# EAGLE design ENGI301_Maze_Project_v2 (EAGLE 9.0.0)
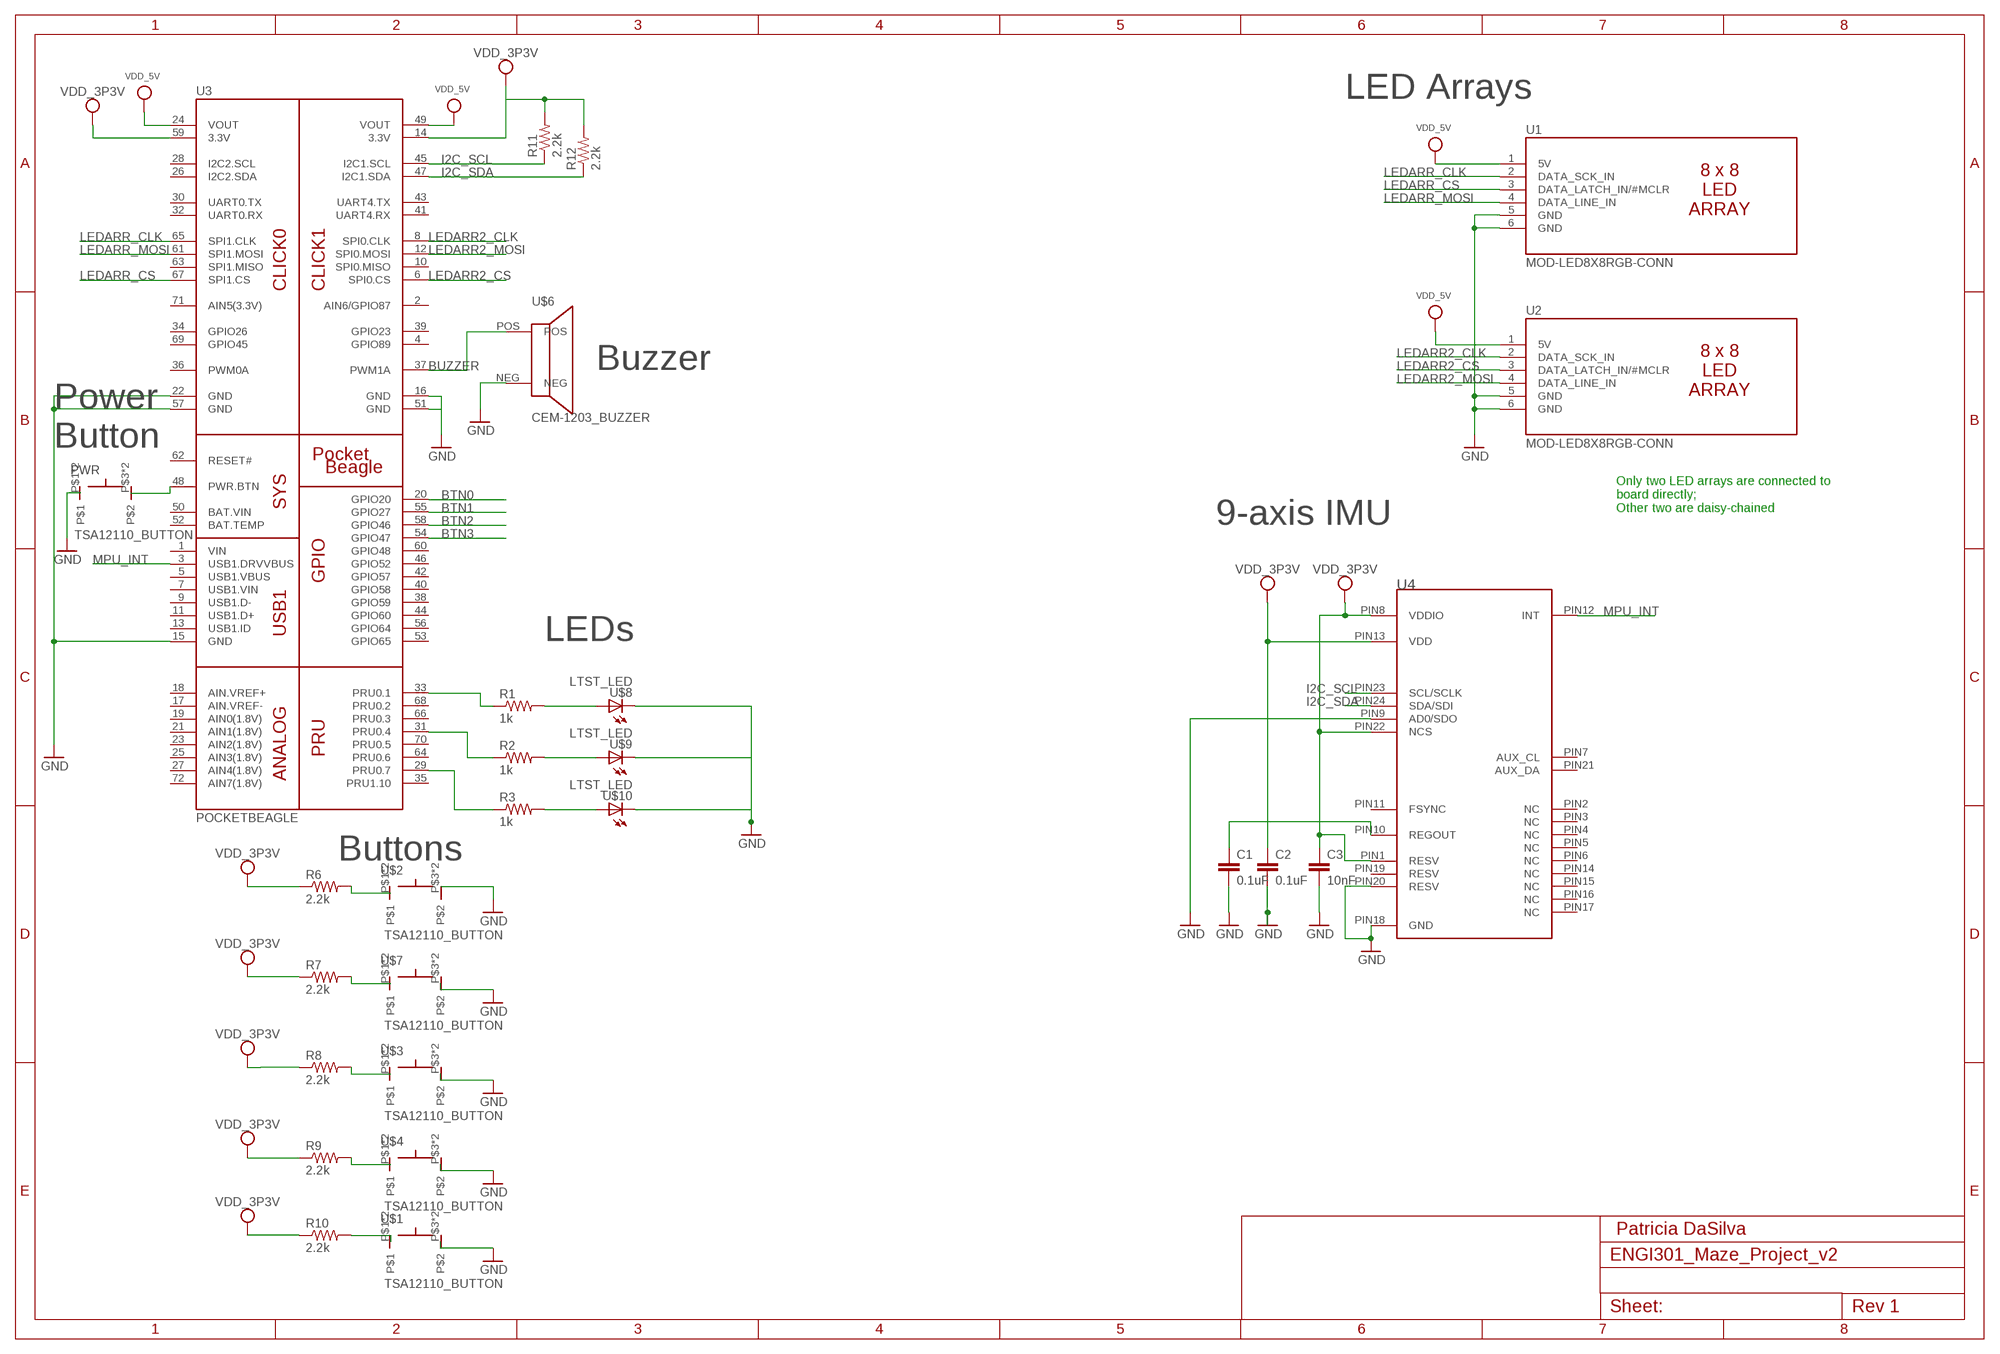
[diagram p0: schematic, sheet 1]

## Parts
C1  0.1uF  C_C0402  [C0402]
C2  0.1uF  C_C0402  [C0402]
C3  10nF  C_C0402  [C0402]
PWR  TSA12110_BUTTON  [4HOLE-THRU]
R1  1k  R_R0603  [R0603]
R2  1k  R_R0603  [R0603]
R3  1k  R_R0603  [R0603]
R6  2.2k  R_R0603  [R0603]
R7  2.2k  R_R0603  [R0603]
R8  2.2k  R_R0603  [R0603]
R9  2.2k  R_R0603  [R0603]
R10  2.2k  R_R0603  [R0603]
R11  2.2k  R_R0603  [R0603]
R12  2.2k  R_R0603  [R0603]
U1  MOD-LED8X8RGB-CONN  [FE06W]
U2  MOD-LED8X8RGB-CONN  [FE06W]
U3  POCKETBEAGLE  [POCKETBEAGLE]
U4  IMU_MPU9250  [IMU_QFN_3MMX3MM]
U$1  TSA12110_BUTTON  [4HOLE-THRU]
U$2  TSA12110_BUTTON  [4HOLE-THRU]
U$3  TSA12110_BUTTON  [4HOLE-THRU]
U$4  TSA12110_BUTTON  [4HOLE-THRU]
U$6  CEM-1203_BUZZER  [2HOLE-THRU]
U$7  TSA12110_BUTTON  [4HOLE-THRU]
U$8  LTST_LED  [SMD_0.8X0.8MM]
U$9  LTST_LED  [SMD_0.8X0.8MM]
U$10  LTST_LED  [SMD_0.8X0.8MM]

## Nets
BTN0: U3.20(GPIO20)
BTN1: U3.55(GPIO27)
BTN2: U3.58(GPIO46)
BTN3: U3.54(GPIO47)
BUZZER: U3.37(PWM1A) U$6.POS
GND: C1.2 C2.2 C3.2 PWR.P$1 PWR.P$2 U1.5(GND) U1.6(GND) U2.5(GND) U2.6(GND) U3.15(GND) U3.16(GND) U3.22(GND) U3.51(GND) U3.57(GND) U4.PIN9(AD0/SDO) U4.PIN18(GND) U4.PIN20(RESV) U$1.P$3 U$1.P$4 U$3.P$3 U$3.P$4 U$4.P$3 U$4.P$4 U$6.NEG U$7.P$3 U$7.P$4 U$8.C(CATHODE) U$9.C(CATHODE) U$10.C(CATHODE)
I2C_SCL: R11.1 U3.45(I2C1.SCL) U4.PIN23(SCL/SCLK)
I2C_SDA: R12.1 U3.47(I2C1.SDA) U4.PIN24(SDA/SDI)
LEDARR2_CLK: U2.2(DATA_SCK_IN) U3.8(SPI0.CLK)
LEDARR2_CS: U2.3(DATA_LATCH_IN/#MCLR) U3.6(SPI0.CS)
LEDARR2_MOSI: U2.4(DATA_LINE_IN) U3.12(SPI0.MOSI)
LEDARR_CLK: U1.2(DATA_SCK_IN) U3.65(SPI1.CLK)
LEDARR_CS: U1.3(DATA_LATCH_IN/#MCLR) U3.67(SPI1.CS)
LEDARR_MOSI: U1.4(DATA_LINE_IN) U3.61(SPI1.MOSI)
MPU_INT: U3.3(USB1.DRVVBUS) U4.PIN12(INT)
N$1: PWR.P$3 PWR.P$4 U3.48(PWR.BTN)
N$2: R1.1 U3.33(PRU0.1)
N$3: R2.1 U3.31(PRU0.4)
N$4: C1.1 U4.PIN10(REGOUT)
N$5: R3.1 U3.29(PRU0.7)
N$6: R6.2 U$2.P$1 U$2.P$2
N$7: R1.2 U$8.A(ANODE)
N$8: R7.2 U$7.P$1 U$7.P$2
N$9: R2.2 U$9.A(ANODE)
N$10: R8.2 U$3.P$1 U$3.P$2
N$11: R3.2 U$10.A(ANODE)
N$12: R9.2 U$4.P$1 U$4.P$2
N$13: R10.2 U$1.P$1 U$1.P$2
SYS_VDD1_3P3V: C2.1 C3.1 R6.1 R7.1 R8.1 R9.1 R10.1 R11.2 R12.2 U3.14(3.3V) U3.59(3.3V) U4.PIN1(RESV) U4.PIN8(VDDIO) U4.PIN13(VDD) U4.PIN22(NCS) ; supply symbol labelled VDD_3P3V
SYS_VDD1_5V: U1.1(5V) U2.1(5V) U3.24(VOUT) U3.49(VOUT) ; supply symbol labelled VDD_5V
Unconnected: U3.1(VIN) U3.2(AIN6/GPIO87) U3.4(GPIO89) U3.5(USB1.VBUS) U3.7(USB1.VIN) U3.9(USB1.D-) U3.10(SPI0.MISO) U3.11(USB1.D+) U3.13(USB1.ID) U3.17(AIN.VREF-) U3.18(AIN.VREF+) U3.19(AIN0(1.8V)) U3.21(AIN1(1.8V)) U3.23(AIN2(1.8V)) U3.25(AIN3(1.8V)) U3.26(I2C2.SDA) U3.27(AIN4(1.8V)) U3.28(I2C2.SCL) U3.30(UART0.TX) U3.32(UART0.RX) U3.34(GPIO26) U3.35(PRU1.10) U3.36(PWM0A) U3.38(GPIO59) U3.39(GPIO23) U3.40(GPIO58) U3.41(UART4.RX) U3.42(GPIO57) U3.43(UART4.TX) U3.44(GPIO60) U3.46(GPIO52) U3.50(BAT.VIN) U3.52(BAT.TEMP) U3.53(GPIO65) U3.56(GPIO64) U3.60(GPIO48) U3.62(RESET#) U3.63(SPI1.MISO) U3.64(PRU0.6) U3.66(PRU0.3) U3.68(PRU0.2) U3.69(GPIO45) U3.70(PRU0.5) U3.71(AIN5(3.3V)) U3.72(AIN7(1.8V)) U4.PIN2(NC) U4.PIN3(NC) U4.PIN4(NC) U4.PIN5(NC) U4.PIN6(NC) U4.PIN7(AUX_CL) U4.PIN11(FSYNC) U4.PIN14(NC) U4.PIN15(NC) U4.PIN16(NC) U4.PIN17(NC) U4.PIN19(RESV) U4.PIN21(AUX_DA) U$2.P$3 U$2.P$4

## Notes on the sheet
- LED Arrays
- Buzzer
- Power 
  Button
- Only two LED arrays are connected to 
  board directly; 
  Other two are daisy-chained
- 9-axis IMU
- LEDs
- Buttons
- Patricia DaSilva

## Library data of the parts
C1-C3 = IMU:C_: Capacitor SMD. Sizes: 0402, 0603 & 0805
PWR U$1-U$4 U$7 = Project#2:TSA12110_BUTTON: A 4-pin button
R1-R3 R6-R12 = Project#2:R_: RESISTOR, American symbol
U1 U2 = Project#2:MOD-LED8X8RGB-CONN
U3 = Project#2:POCKETBEAGLE
U4 = Project#2:IMU_MPU9250: MPU9250 is a motion tracking device consisting of a QFN (3mm x 3mm) package
U$6 = Project#2:CEM-1203_BUZZER: A buzzer
U$8-U$10 = Project#2:LTST_LED: An LED ( 0.8x0.8MM SMD )

## Board
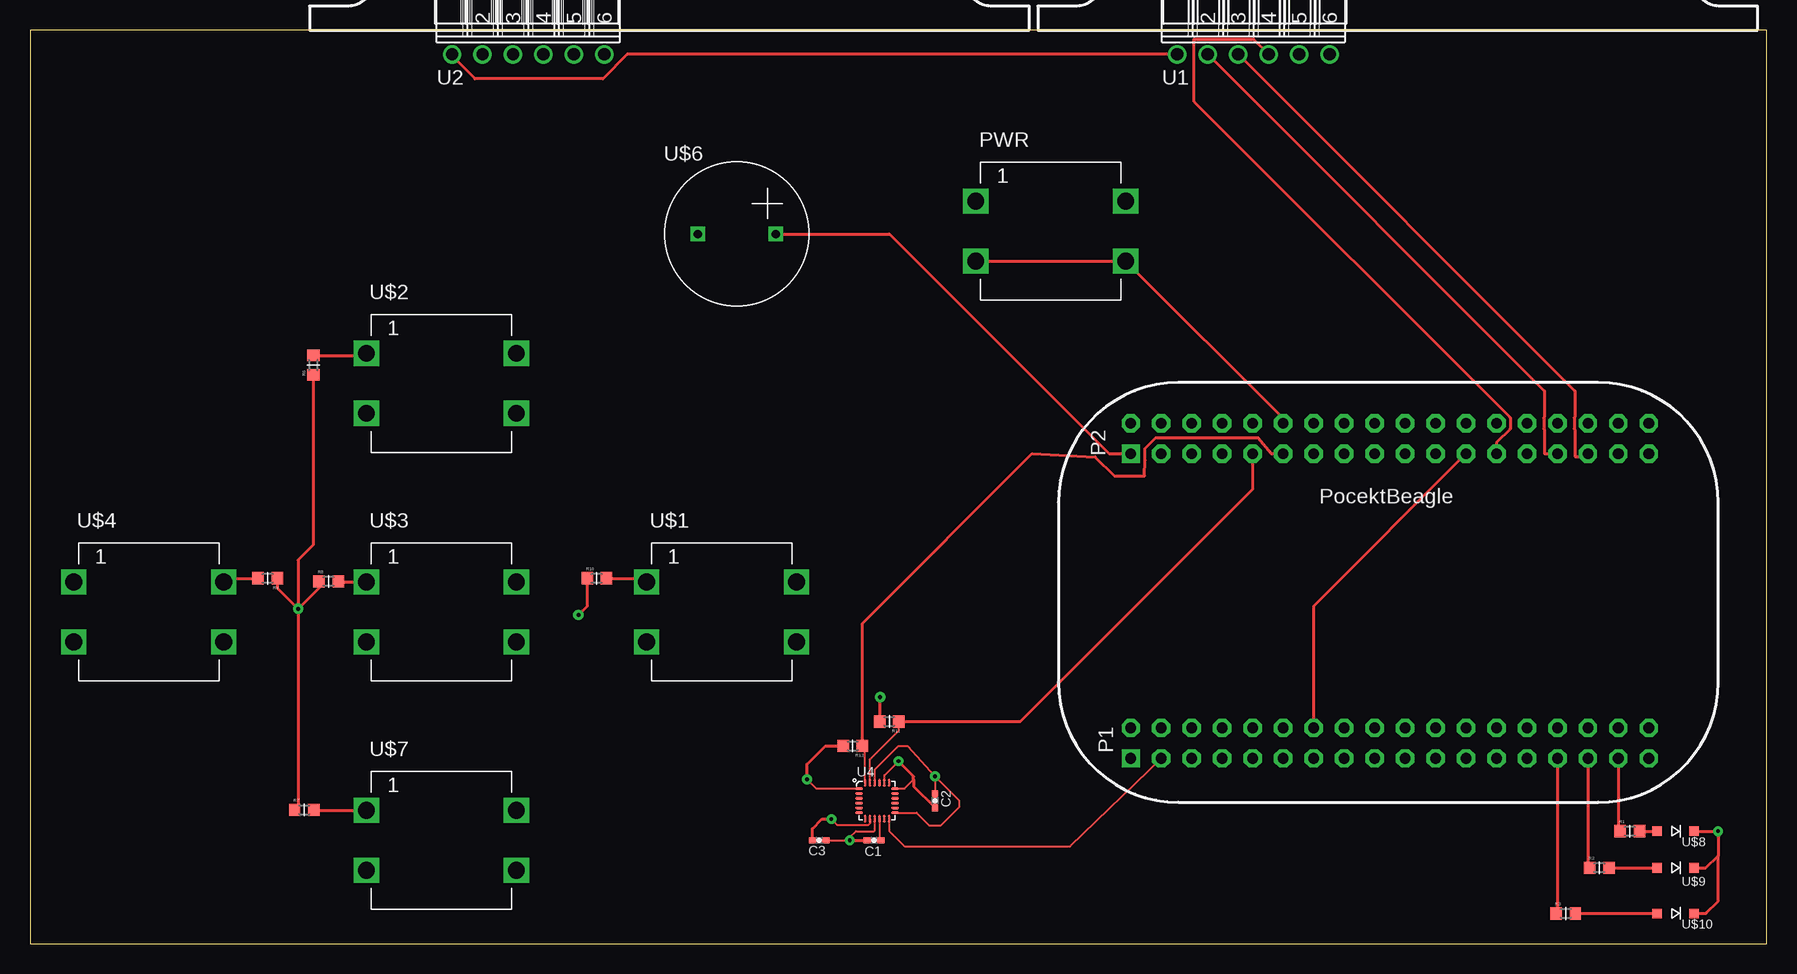
[diagram p1: board, top side]
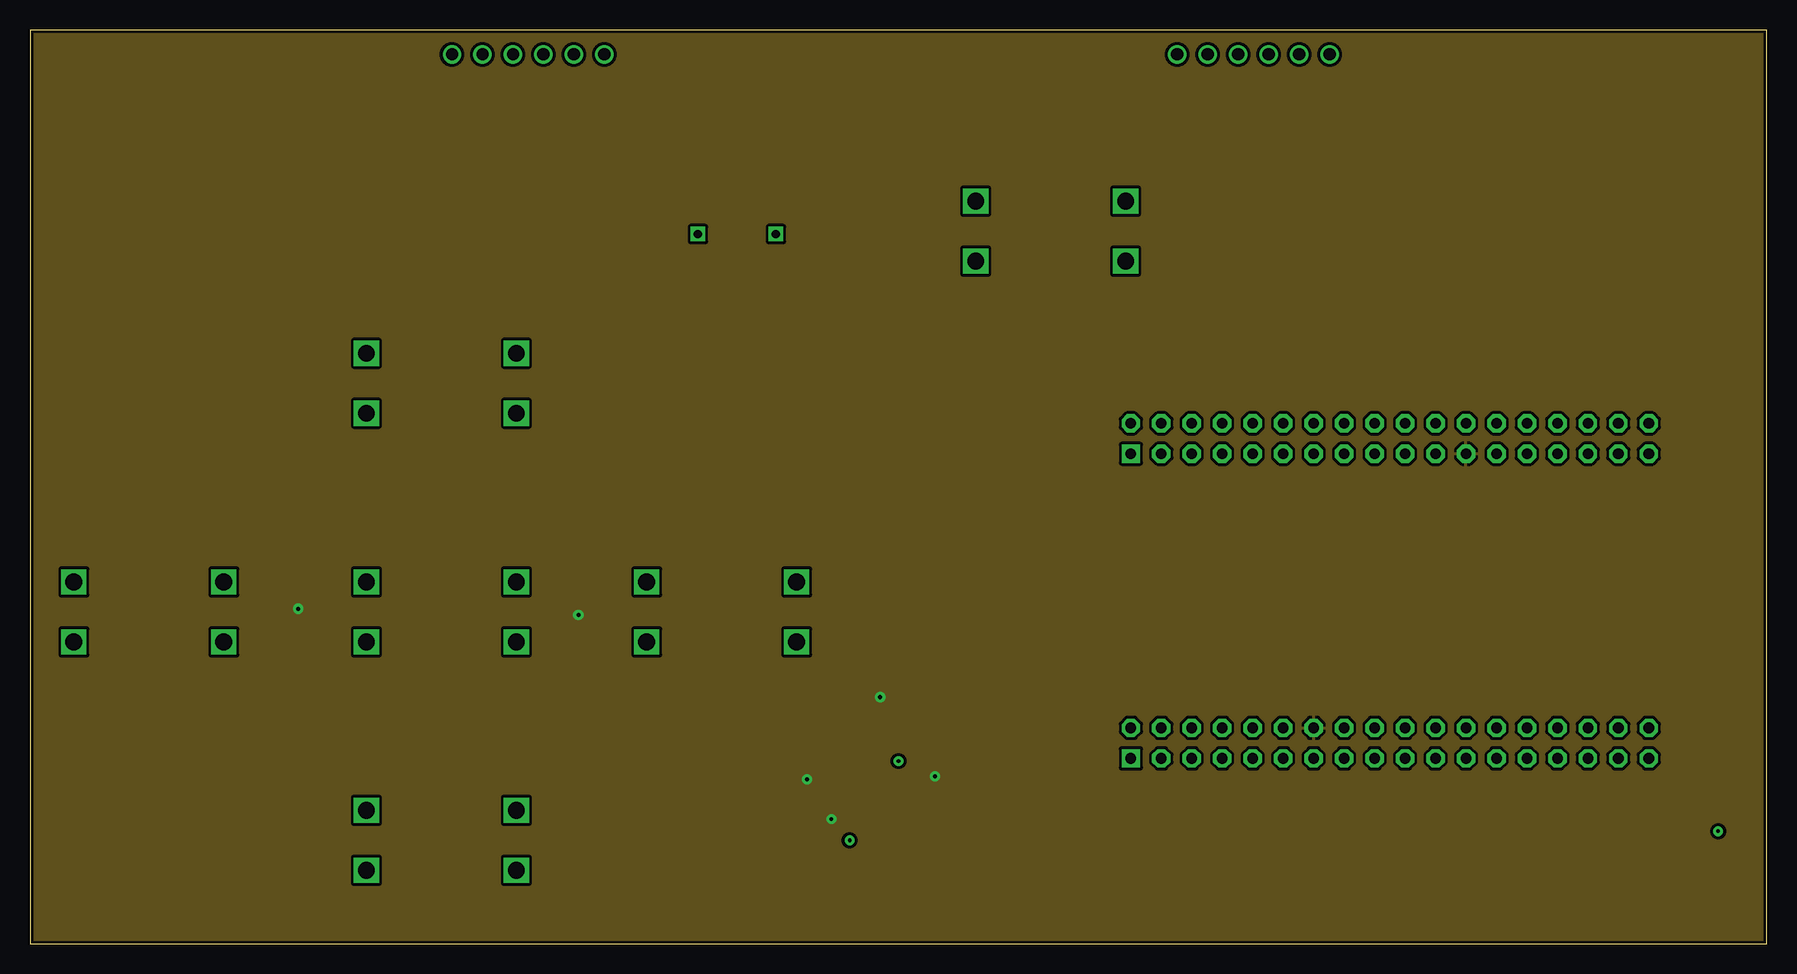
[diagram p2: board, inner layer Route2]
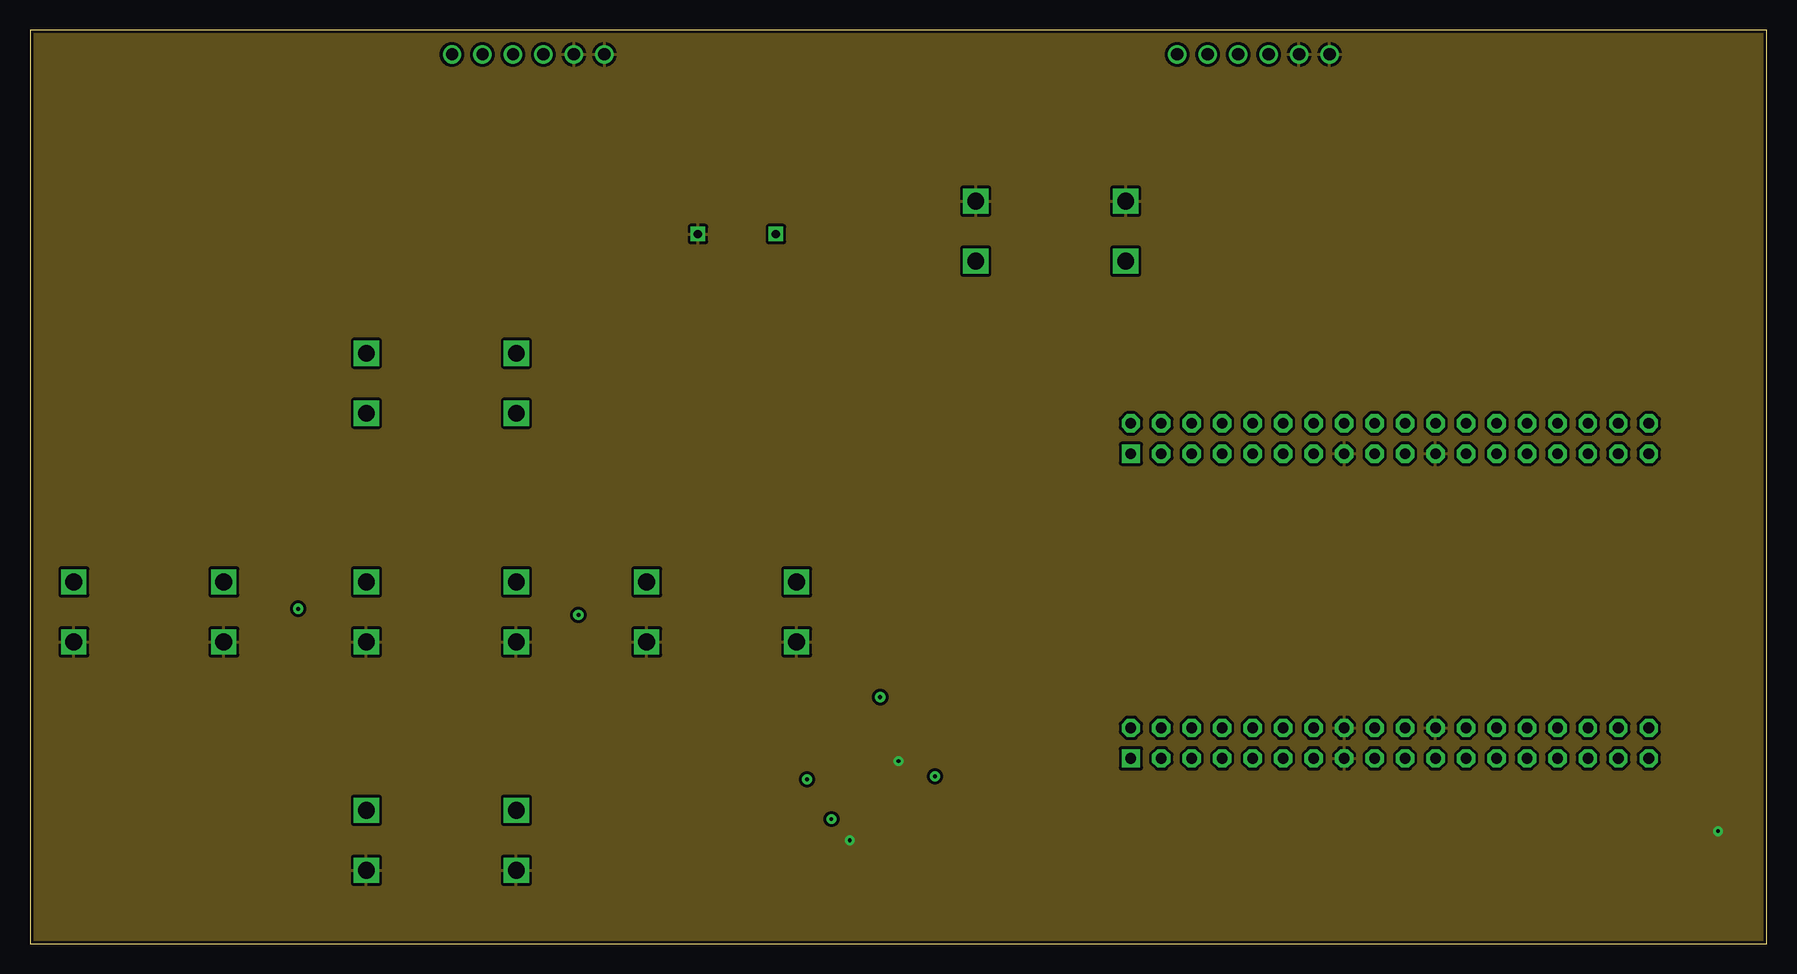
[diagram p3: board, inner layer Route15]
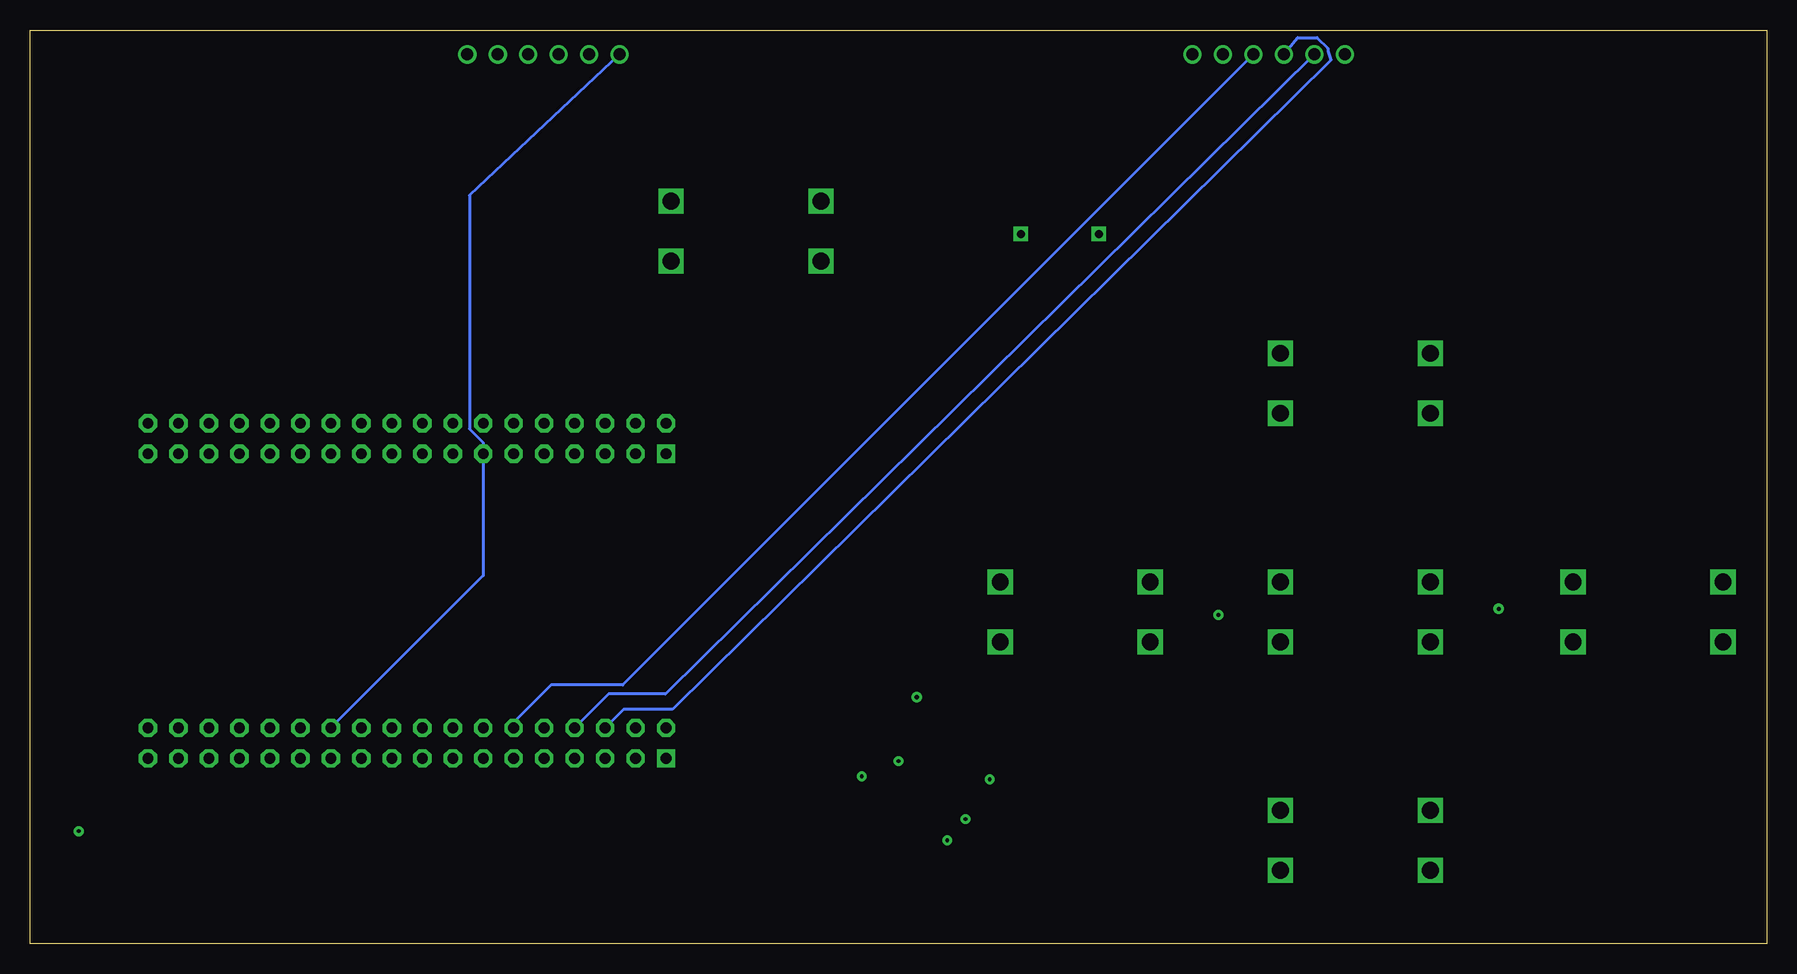
[diagram p4: board, bottom side, seen from below]

Size 144.78 x 76.2 mm. Coordinates in mm from the lower left corner, seen from the top.
Outline: 0,0 144.78,0 144.78,76.2 0,76.2 0,0
Copper layers (1*2*15*16): Top 0.035mm / dielectric 0.23mm / Route2 0.035mm / dielectric 0.93mm / Route15 0.035mm / dielectric 0.23mm / Bottom 0.035mm
Design rules "ENGI301_Maze_Project_4lyr": minimum track width 10mil, minimum drill 12mil, track to track 10mil, track to pad 10mil, pad to pad 10mil, via to via 10mil, smd to smd 10mil, copper to edge 10mil, drill to drill 12mil, minimum pad ring 10mil, minimum via ring 10mil, stop-mask expansion 3mil, vias tented up to drill 25mil, thermal gap 10mil

### Footprints (pad centres in the part's own frame; a part is rotated, then mirrored left to right if it is on the bottom)
C0402 = smd 0.61 x 0.508: 1 -0.559,0; 2 0.559,0
4HOLE-THRU = drill 1.4 square: P$1 -6.25,2.5; P$2 6.25,2.5; P$3 -6.25,-2.5; P$4 6.25,-2.5
R0603 = smd 0.95 x 1.031: 1 -0.8,0; 2 0.8,0
FE06W = drill 1.016: 1 -6.35,0; 2 -3.81,0; 3 -1.27,0; 4 1.27,0; 5 3.81,0; 6 6.35,0
POCKETBEAGLE = drill 0.889 pad 1.524 square: 1 5.91,3.53; 37 5.91,28.93 | drill 0.889 pad 1.524 octagon: 2 5.91,6.07; 3 8.45,3.53; 4 8.45,6.07; 5 10.99,3.53; 6 10.99,6.07; 7 13.53,3.53; 8 13.53,6.07; 9 16.07,3.53; 10 16.07,6.07; 11 18.61,3.53; 12 18.61,6.07; 13 21.15,3.53; 14 21.15,6.07; 15 23.69,3.53; 16 23.69,6.07; 17 26.23,3.53; 18 26.23,6.07; 19 28.77,3.53; 20 28.77,6.07; 21 31.31,3.53; 22 31.31,6.07; 23 33.85,3.53; 24 33.85,6.07; 25 36.39,3.53; 26 36.39,6.07; 27 38.93,3.53; 28 38.93,6.07; 29 41.47,3.53; 30 41.47,6.07; 31 44.01,3.53; 32 44.01,6.07; 33 46.55,3.53; 34 46.55,6.07; 35 49.09,3.53; 36 49.09,6.07; 38 5.91,31.47; 39 8.45,28.93; 40 8.45,31.47; 41 10.99,28.93; 42 10.99,31.47; 43 13.53,28.93; 44 13.53,31.47; 45 16.07,28.93; 46 16.07,31.47; 47 18.61,28.93; 48 18.61,31.47; 49 21.15,28.93; 50 21.15,31.47; 51 23.69,28.93; 52 23.69,31.47; 53 26.23,28.93; 54 26.23,31.47; 55 28.77,28.93; 56 28.77,31.47; 57 31.31,28.93; 58 31.31,31.47; 59 33.85,28.93; 60 33.85,31.47; 61 36.39,28.93; 62 36.39,31.47; 63 38.93,28.93; 64 38.93,31.47; 65 41.47,28.93; 66 41.47,31.47; 67 44.01,28.93; 68 44.01,31.47; 69 46.55,28.93; 70 46.55,31.47; 71 49.09,28.93; 72 49.09,31.47
IMU_QFN_3MMX3MM = smd 0.6 x 0.2: PIN1 -1.5,1; PIN2 -1.5,0.6; PIN3 -1.5,0.2; PIN4 -1.5,-0.2; PIN5 -1.5,-0.6; PIN6 -1.5,-1; PIN13 1.5,-1; PIN14 1.5,-0.6; PIN15 1.5,-0.2; PIN16 1.5,0.2; PIN17 1.5,0.6; PIN18 1.5,1 | smd 0.2 x 0.6: PIN7 -1,-1.5; PIN8 -0.6,-1.5; PIN9 -0.2,-1.5; PIN10 0.2,-1.5; PIN11 0.6,-1.5; PIN12 1,-1.5; PIN19 1,1.5; PIN20 0.6,1.5; PIN21 0.2,1.5; PIN22 -0.2,1.5; PIN23 -0.6,1.5; PIN24 -1,1.5
2HOLE-THRU = drill 0.7 pad 0.7 square: NEG 0,-3.25; POS 0,3.25
SMD_0.8X0.8MM = smd 0.8 x 0.8: A -1.55,0; C 1.55,0

### Placement (x,y rotation side)
C1  70.36,8.64 180 top
C2  75.44,11.94 270 top
C3  65.79,8.64 0 top
PWR  85.09,59.44 0 top
R1  133.35,9.4 0 top
R2  130.81,6.35 0 top
R3  128.02,2.54 0 top
R6  23.62,48.26 90 top
R7  22.86,11.18 0 top
R8  24.89,30.23 0 top
R9  19.81,30.48 180 top
R10  47.24,30.48 0 top
R11  71.63,18.54 180 top
R12  68.58,16.51 180 top
U1  101.98,74.17 0 top
U2  41.53,74.17 0 top
U3  85.85,11.94 0 top
U4  70.61,11.94 0 top
U$1  57.66,27.69 0 top
U$2  34.29,46.74 0 top
U$3  34.29,27.69 0 top
U$4  9.91,27.69 0 top
U$5  [MOD-LED8X8RGB]  83.31,76.2 90 top
U$6  58.93,59.18 270 top
U$7  34.29,8.64 0 top
U$8  137.16,9.4 0 top
U$9  137.16,6.35 0 top
U$10  137.16,2.54 0 top
U$11  [MOD-LED8X8RGB]  144.02,76.2 90 top

### Tracks (layer width: path | path; a pad name or v marks a point on that pad's centre or on a via)
BUZZER
  Top 0.254: U$6.POS 71.63,59.18 89.94,40.87 U3.37
GND  (via drill 0.3 pad 0.61)
  Top 0.152: 72.14,12.96 U4.PIN18 72.13,12.95 72.9,12.95 73.66,13.72 | U4.PIN20 71.21,14.06 v72.39,15.24 | C3.2 v68.33,8.64 68.33,8.89 68.83,9.4 70.36,9.4 70.41,9.45 U4.PIN9
  Top 0.254: U$9.C 139.7,6.35 140.72,7.37 | U$10.C 139.7,2.54 140.72,3.56 140.72,7.37 | U$8.C v140.72,9.4 140.72,7.37 | v68.33,8.64 C1.2 | v72.39,15.24 73.66,13.97 73.66,13.72 73.66,13.16 C2.2
  pour Route15: -0.76,76.96 -0.76,-0.76 145.54,-0.76 145.54,76.96
I2C_SCL
  Top 0.152: U4.PIN23 70.01,15.4 72.43,17.82 R11.1
  Top 0.254: R11.1 82.55,18.54 101.92,37.91 U3.45
I2C_SDA
  Top 0.152: U4.PIN24 69.61,16.28 R12.1
  Top 0.254: R12.1 69.38,26.71 83.54,40.87 88.79,40.61 90.39,39.01 92.92,39.01 92.96,40.33 92.96,41.32 93.85,42.21 102.37,42.21 103.47,40.87 U3.47
LEDARR2_CLK
  Bottom 0.254: U2.2 91.82,20.83 96.56,20.83 U3.8
LEDARR2_CS
  Bottom 0.254: U2.3 39.12,75.56 37.5,75.56 36.61,74.68 36.58,74.42 36.32,73.69 91.22,19.56 95.29,19.56 U3.6
LEDARR2_MOSI
  Bottom 0.254: U2.4 95.38,21.59 101.35,21.59 104.46,18.47 U3.12
LEDARR_CLK
  Top 0.254: U1.2 126.24,46.1 126.24,43.94 126.18,43.88 126.18,42.94 126.24,42.88 126.24,40.89 126.26,40.87 U3.65
LEDARR_CS
  Top 0.254: U1.3 128.78,46.1 128.78,43.94 128.72,43.88 128.72,42.94 128.78,42.88 128.78,40.64 129.63,40.64 U3.67
LEDARR_MOSI
  Top 0.254: U3.61 122.24,41.79 123.39,42.94 123.39,43.88 97.03,70.24 97.03,75.44 101.98,75.44 U1.4
MPU_INT
  Top 0.152: U4.PIN12 71.61,9.41 72.9,8.13 86.71,8.13 U3.3
N$1
  Top 0.254: U3.48 104.46,43.81 91.41,56.87 PWR.P$4 PWR.P$3
N$2
  Top 0.254: U3.33 132.4,9.55 R1.1
N$3
  Top 0.254: U3.31 129.86,6.5 R2.1
N$4
  Top 0.152: U4.PIN10 70.81,8.74 C1.1
N$5
  Top 0.254: U3.29 127.32,2.65 R3.1
N$6
  Top 0.254: R6.2 27.86,49.06 U$2.P$1
N$7
  Top 0.254: R1.2 U$8.A
N$8
  Top 0.254: R7.2 23.7,11.14 U$7.P$1
N$9
  Top 0.254: R2.2 U$9.A
N$10
  Top 0.254: R8.2 25.73,30.19 U$3.P$1
N$11
  Top 0.254: R3.2 U$10.A
N$12
  Top 0.254: U$4.P$2 16.45,30.48 R9.2
N$13
  Top 0.254: R10.2 51.11,30.48 U$1.P$1
SYS_VDD1_3P3V  (via drill 0.3 pad 0.61, 0.35)
  Top 0.152: U4.PIN8 70.01,10.07 69.85,9.91 67.31,9.91 v66.8,10.41 | R11.2 70.87,18.58 | v75.44,13.97 C2.1 | U4.PIN22 70.41,14.53 72.39,16.51 73.15,16.51 v75.44,13.97 | U4.PIN13 73.9,10.94 74.93,9.91 75.95,9.91 77.47,11.43 77.47,11.94 v75.44,13.97 | U4.PIN1 65.55,12.94 v64.77,13.72
  Top 0.254: C3.1 65.23,9.6 66.04,10.41 v66.8,10.41 | v64.77,13.72 64.77,14.99 66.29,16.51 R12.2 | 70.87,18.58 v70.87,20.57 | U3.14 107,28.17 U3.59 | R9.1 20.61,29.68 v22.35,27.94 | R8.1 24.09,29.68 v22.35,27.94 | v22.35,27.94 22.35,11.47 R7.1 | R6.1 23.62,33.27 22.35,32 v22.35,27.94 | R10.1 46.44,28.16 v45.72,27.43
  pour Route2: -0.38,76.58 -0.38,-0.38 145.16,-0.38 145.16,76.58
SYS_VDD1_5V  (via drill 0.35)
  Top 0.254: U1.1 49.78,74.17 47.75,72.14 37.08,72.14 35.18,74.04 U2.1
  Bottom 0.254: U1.1 108.14,62.42 108.14,42.94 107,41.79 U3.49 107,30.71 U3.24
  other vias: 107,40.87